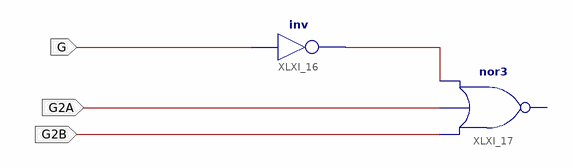
[diagram p0: schematic sheet 1]
// Xilinx ISE schematic HCT138_sch.sch (kintex7) as structural Verilog: 2 symbols, 3 ports
module HCT138_sch (
  input  G,
  input  G2A,
  input  G2B
);

  wire XLXN_60;

  not XLXI_16 (XLXN_60, G);
  // nor3 XLXI_17 has open pins: I0=G2B, I1=G2A, I2=XLXN_60, O=open
endmodule
